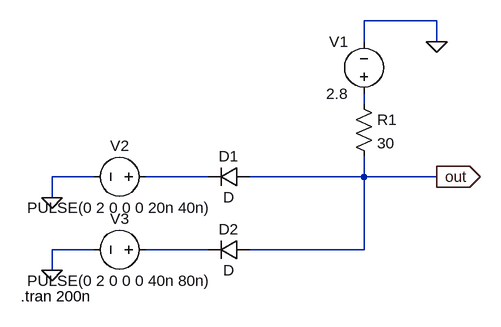
[diagram p0: schematic easy_ans.asc]
easy_ans.asc, the LTspice schematic file:
Version 4.1
SHEET 1 880 680
WIRE 384 -144 272 -144
WIRE 272 -112 272 -144
WIRE 384 -112 384 -144
WIRE 272 -16 272 -32
WIRE -144 96 -208 96
WIRE 32 96 -64 96
WIRE 272 96 272 64
WIRE 272 96 96 96
WIRE 384 96 272 96
WIRE -208 128 -208 96
WIRE -144 208 -208 208
WIRE 32 208 -64 208
WIRE 272 208 272 96
WIRE 272 208 96 208
WIRE -208 240 -208 208
FLAG 384 -112 0
FLAG -208 128 0
FLAG -208 240 0
FLAG 384 96 out
IOPIN 384 96 Out
SYMBOL diode 96 80 R90
WINDOW 0 0 32 VBottom 2
WINDOW 3 32 32 VTop 2
SYMATTR InstName D1
SYMBOL diode 96 192 R90
WINDOW 0 0 32 VBottom 2
WINDOW 3 32 32 VTop 2
SYMATTR InstName D2
SYMBOL voltage 272 -16 R180
WINDOW 0 24 96 Left 2
WINDOW 3 24 16 Left 2
WINDOW 123 0 0 Left 0
WINDOW 39 0 0 Left 0
SYMATTR InstName V1
SYMATTR Value 2.8
SYMBOL voltage -48 96 R90
WINDOW 0 -32 56 VBottom 2
WINDOW 3 32 56 VTop 2
WINDOW 123 0 0 Left 0
WINDOW 39 0 0 Left 0
SYMATTR InstName V2
SYMATTR Value PULSE(0 2 0 0 0 20n 40n)
SYMBOL voltage -48 208 R90
WINDOW 0 -32 56 VBottom 2
WINDOW 3 32 56 VTop 2
WINDOW 123 0 0 Left 0
WINDOW 39 0 0 Left 0
SYMATTR InstName V3
SYMATTR Value PULSE(0 2 0 0 0 40n 80n)
SYMBOL res 256 -32 R0
SYMATTR InstName R1
SYMATTR Value 30
TEXT -256 280 Left 2 !.tran 200n

The netlist it stands for:
* easy_ans.asc
D1 out N002 D
D2 out N003 D
V1 N001 0 2.8
V2 N002 0 PULSE(0 2 0 0 0 20n 40n)
V3 N003 0 PULSE(0 2 0 0 0 40n 80n)
R1 N001 out 30
.model D D
.lib standard.dio
.tran 200n
.backanno
.end